# EAGLE schematic door_lock_v1.0 (EAGLE 9.5.2)

## Sheet 1 of 2
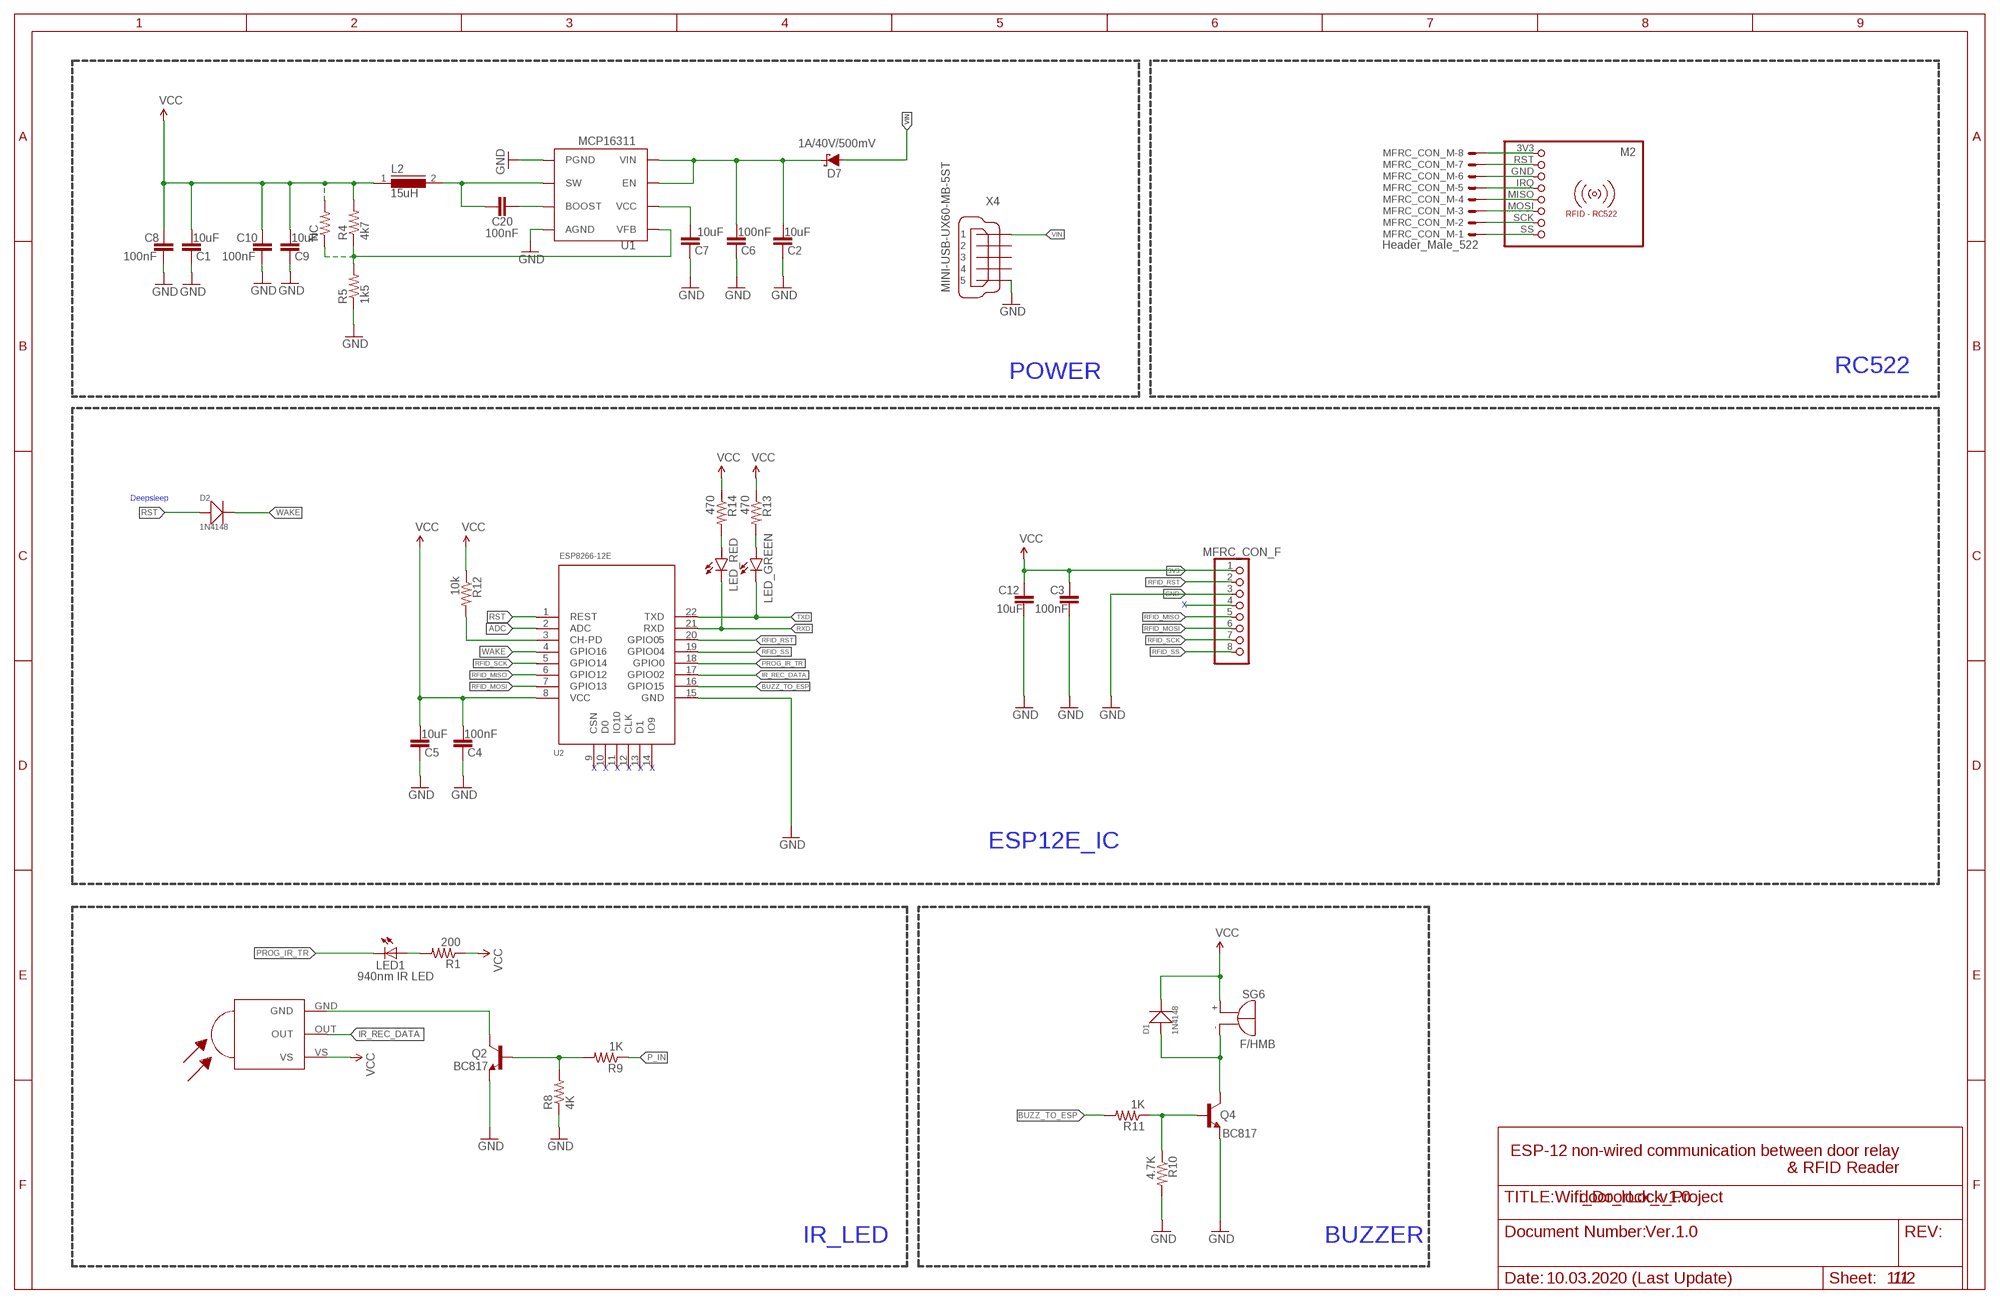
[diagram p0: schematic, sheet 1, part 1 of 2]
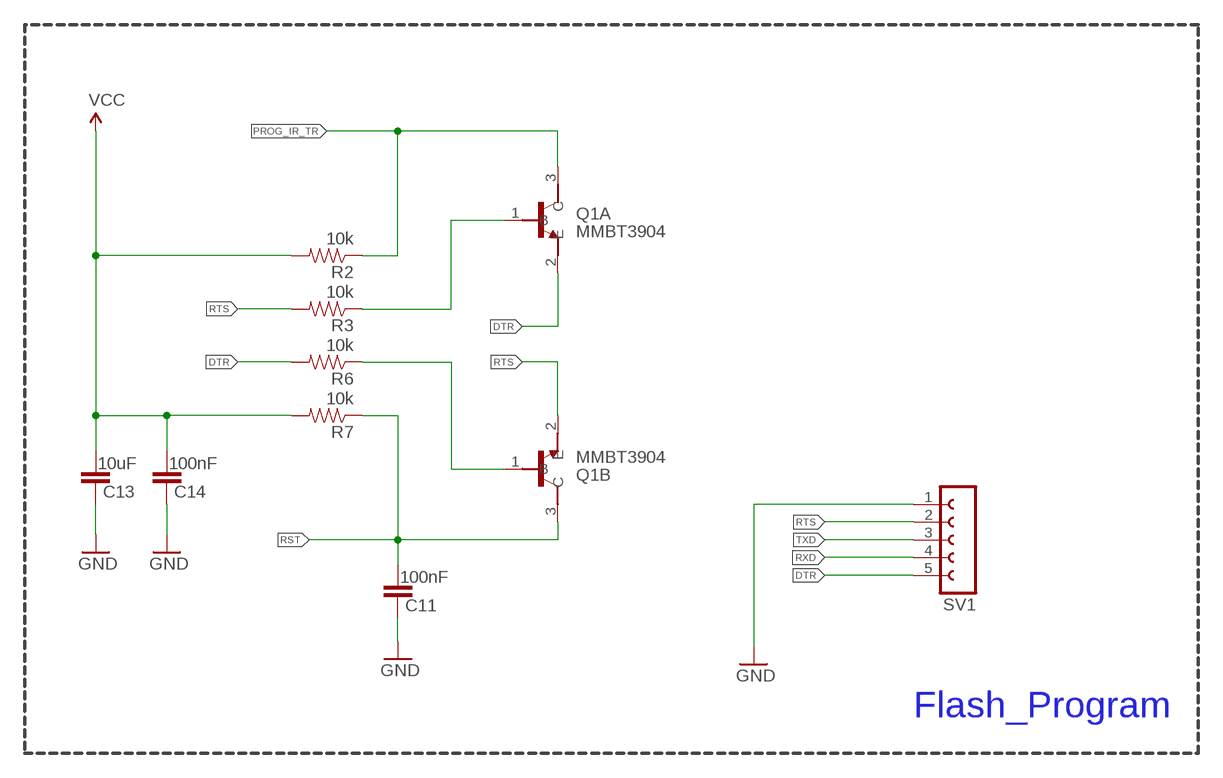
[diagram p1: schematic, sheet 1, part 2 of 2]

### Parts
C1  10uF  C-EUC0805  [C0805]
C2  10uF  C-EUC0805  [C0805]
C3  100nF  C-EUC0805  [C0805]
C4  100nF  C-EUC0805  [C0805]
C5  10uF  C-EUC0805  [C0805]
C6  100nF  C-EUC0805  [C0805]
C7  10uF  C-EUC0805  [C0805]
C8  100nF  C-EUC0805  [C0805]
C9  10uF  C-EUC0805  [C0805]
C10  100nF  C-EUC0805  [C0805]
C11  100nF  C-EUC0805  [C0805]
C12  10uF  C-EUC0805  [C0805]
C13  10uF  C-EUC0805  [C0805]
C14  100nF  C-EUC0805  [C0805]
C20  100nF  C-EUC0805  [C0805]
D1  1N4148  SMD-DIODE-SWITCH-1N4148(LL-34)  [LL-34]
D2  1N4148  SMD-DIODE-SWITCH-1N4148(LL-34)  [LL-34]
D7  1A/40V/500mV  DIODE-SCHOTTKY-SS14  [SMA-DIODE]
L2  15uH  DR74  [DR74]
LED1  940nm IR LED  LEDIRL80A  [IRL80A]
LED_GREEN  LED3MM  [LED3MM]
LED_RED  LED3MM  [LED3MM]
M2  RFID-RC522  [RFID-RC522]
MFRC_CON_F  PINHD-1X8  [1X08]
MFRC_CON_M  Header_Male_522  22-23-2081  [22-23-2081]
NC  SPARKFUN_RESISTOR0805-RES  [SPARKFUN_0805]
Q1A  MMBT3904  [SOT95P240X120-3N]
Q1B  MMBT3904  [SOT95P240X120-3N]
Q2  BC817  TRANSISTOR_BJT_NPN-SOT-23-BCE  [SOT-23]
Q4  BC817  TRANSISTOR_BJT_NPN-SOT-23-BCE  [SOT-23]
R1  200  SPARKFUN_RESISTOR0805-RES  [SPARKFUN_0805]
R2  10k  SPARKFUN_RESISTOR0805-RES  [SPARKFUN_0805]
R3  10k  SPARKFUN_RESISTOR0805-RES  [SPARKFUN_0805]
R4  4k7  SPARKFUN_RESISTOR0805-RES  [SPARKFUN_0805]
R5  1k5  SPARKFUN_RESISTOR0805-RES  [SPARKFUN_0805]
R6  10k  SPARKFUN_RESISTOR0805-RES  [SPARKFUN_0805]
R7  10k  SPARKFUN_RESISTOR0805-RES  [SPARKFUN_0805]
R8  4K  R-US_M0805  [M0805]
R9  1K  R-US_M0805  [M0805]
R10  4.7K  R-US_M0805  [M0805]
R11  1K  R-US_M0805  [M0805]
R12  10k  SPARKFUN_RESISTOR0805-RES  [SPARKFUN_0805]
R13  470  SPARKFUN_RESISTOR0805-RES  [SPARKFUN_0805]
R14  470  SPARKFUN_RESISTOR0805-RES  [SPARKFUN_0805]
SG6  F/HMB  [F/HMB]
SV1  FE05-1  [FE05-1]
U1  MCP16311  [MSOP8]
U2  ESP8266-12E  MOUDLE-WIFI-ESP8266-12E/ESP-12E(22P-24X16MM)  [LGA22-2.0-24X16MM]
U$3  TSOP18  TSOP38238  [TSOP-382]
X4  MINI-USB-UX60-MB-5ST  [UX60-MB-5ST]

### Nets
3V3: C3.1 C12.1 MFRC_CON_F.1 ; supply symbol labelled VCC
ADC: U2.2(ADC)
BUZZ_TO_ESP: R11.2 U2.16(GPIO15)
CH_PD: R12.2 U2.3(CH-PD)
DTR: Q1A.2(E) R6.2 SV1.5
GND: C1.1 C2.1 C3.2 C4.1 C5.1 C6.1 C7.1 C8.2 C9.1 C10.2 C11.1 C12.2 C13.1 C14.1 MFRC_CON_F.3 Q2.3(E) Q4.3(E) R5.1 R8.1 R10.2 SV1.1 U1.AGND U1.PGND U2.15(GND) X4.5
IR_REC_DATA: U2.17(GPIO02) U$3.OUT
N$1: LED_RED.A R14.2
N$2: LED1.A R1.2
N$3: Q4.1(B) R10.1 R11.1
N$4: D1.A(+) Q4.2(C) SG6.-
N$5: Q1A.1(B) R3.1
N$6: Q1B.1(B) R6.1
N$7: Q2.1(B) R8.2 R9.2
N$8: C20.2 L2.2 U1.SW
N$9: C20.1 U1.BOOST
N$10: Q2.2(C) U$3.GND
N$11: C7.2 U1.VCC
N$12: C2.2 C6.2 D7.C U1.EN U1.VIN
N$13: LED_GREEN.A R13.2
N$14: NC.1 R4.1 R5.2 U1.VFB
N$15: M2.SS MFRC_CON_M.1
N$16: M2.SCK MFRC_CON_M.2
N$17: MFRC_CON_F.4
N$18: M2.MOSI MFRC_CON_M.3
N$19: M2.MISO MFRC_CON_M.4
N$20: M2.IRQ MFRC_CON_M.5
N$21: M2.GND MFRC_CON_M.6
N$22: M2.RST MFRC_CON_M.7
N$23: M2.3V3 MFRC_CON_M.8
P_IN: R9.1
PROG_IR_TR: LED1.K(C) Q1A.3(C) R2.1 U2.18(GPIO0)
RFID_MISO: MFRC_CON_F.5 U2.6(GPIO12)
RFID_MOSI: MFRC_CON_F.6 U2.7(GPIO13)
RFID_RST: MFRC_CON_F.2 U2.20(GPIO05)
RFID_SCK: MFRC_CON_F.7 U2.5(GPIO14)
RFID_SS: MFRC_CON_F.8 U2.19(GPIO04)
RST: C11.2 D2.A(+) Q1B.3(C) R7.1 U2.1(REST)
RTS: Q1B.2(E) R3.2 SV1.2
RXD: LED_RED.K(C) SV1.4 U2.21(RXD)
TXD: LED_GREEN.K(C) SV1.3 U2.22(TXD)
VCC: C1.2 C4.2 C5.2 C8.1 C9.2 C10.1 C13.2 C14.2 D1.C(-) L2.1 NC.2 R1.1 R2.2 R4.2 R7.2 R12.1 R13.1 R14.1 SG6.+ U2.8(VCC) U$3.VS
VIN: D7.A X4.1
WAKE: D2.C(-) U2.4(GPIO16)
Unconnected: U2.9(CSN) U2.10(D0) U2.11(IO10) U2.12(CLK) U2.13(D1) U2.14(IO9) X4.2 X4.3 X4.4

### Notes on the sheet
- Flash_Program
- POWER | RC522
- Deepsleep
- X
- X | X | X | X | X | X
- ESP12E_IC
- ESP-12 non-wired communication between door relay
  & RFID Reader
- Wifi_DoorLock_Project
- Ver.1.0
- IR_LED | BUZZER
- 10.03.2020 (Last Update) | 1/1

## Sheet 2 of 2

## Library data of the parts
C1-C14 C20 = rcl:C-EU: CAPACITOR, European symbol; SPICEPREFIX: C
D1 D2 = Seeed-Diode-2016:SMD-DIODE-SWITCH-1N4148(LL-34): 304040016; MPN: 1N4148
D7 = SparkFun-DiscreteSemi:DIODE-SCHOTTKY: Schottky diode A Schottky diode is a semiconductor diode which has a low forward voltage drop and a very fast switching action.; PROD_ID: DIO-08053
L2 = inductors:DR74: High Power Density, High Efficiency, Shielded Inductors Source: coiltronics_dr_series.pdf; SPICEPREFIX: L
LED1 = adafruit:LED: LED
LED_GREEN LED_RED = led:LED: LED
M2 = mfrc522-module:RFID-RC522: RFID-RC522 MFRC-522 based breakout board
MFRC_CON_F = pinhead:PINHD-1X8: PIN HEADER
MFRC_CON_M = con-molex:22-23-2081: .100" (2.54mm) Center Header - 8 Pin; MF: MOLEX; MPN: 22-23-2081; OC_FARNELL: 1756826; OC_NEWARK: 01C7592
NC R1-R7 R12-R14 = antduino:SPARKFUN_RESISTOR: Resistor Basic schematic elements and footprints for 0603, 1206, and PTH resistors.
Q1A Q1B = MMBT3904:MMBT3904: MMBT3904 Series 40 V CE Breakdown 0.2 A NPN General Purpose Amplifier - SOT-23; AVAILABILITY: Unavailable; DESCRIPTION: Bipolar _BJT_ Transistor NPN 40V 200mA 270MHz 350mW Surface Mount SOT-23-3; MF: STMicroelectronics; MP: MMBT3904; PACKAGE: SOT-23-3 Taiwan Semiconductor; PRICE: None
Q2 Q4 = dp_devices:TRANSISTOR_BJT_NPN: Most commonly used is SOT23-BEC
R8-R11 = adafruit:R-US_: RESISTOR, American symbol
SG6 = buzzer:F/HMB: BUZZER Source: Buerklin; OC_FARNELL: unknown; OC_NEWARK: unknown
SV1 = con-lsta:FE05-1: FEMALE HEADER; OC_FARNELL: unknown; OC_NEWARK: unknown
U1 = microchip:MCP16311
U2 = Seeed-OPL-Moudle:MOUDLE-WIFI-ESP8266-12E/ESP-12E(22P-24X16MM): 317060015; MPN: ESP8266-12E/ESP-12E; VALUE: ESP8266-12E/ESP-12E
U$3 = TSOP38238:TSOP38238: 38 kHz 45 m 2.5-5.5 V Through Hole IR Receiver Module for Remote Control System; DESCRIPTION: Remote Receiver Sensor, 38.0kHz 45m Through Hole; DIGI-KEY_PART_NUMBER: 751-1227-ND; DIGI-KEY_PURCHASE_URL: https://www.digikey.com/product-detail/en/vishay-semiconductor-opto-division/TSOP38238/751-1227-ND/1681362?utm_source=snapeda&utm_medium=aggregator&utm_campaign=symbol; MF: Vishay; MP: TSOP38238; PACKAGE: None
X4 = con-hirose:MINI-USB-: MINI USB Connector Source: http://www.hirose.co.jp/cataloge_hp/e24000019.pdf; OC_FARNELL: unknown; OC_NEWARK: unknown